# Altium schematic sheet digital_input_module.SchDoc
size A3
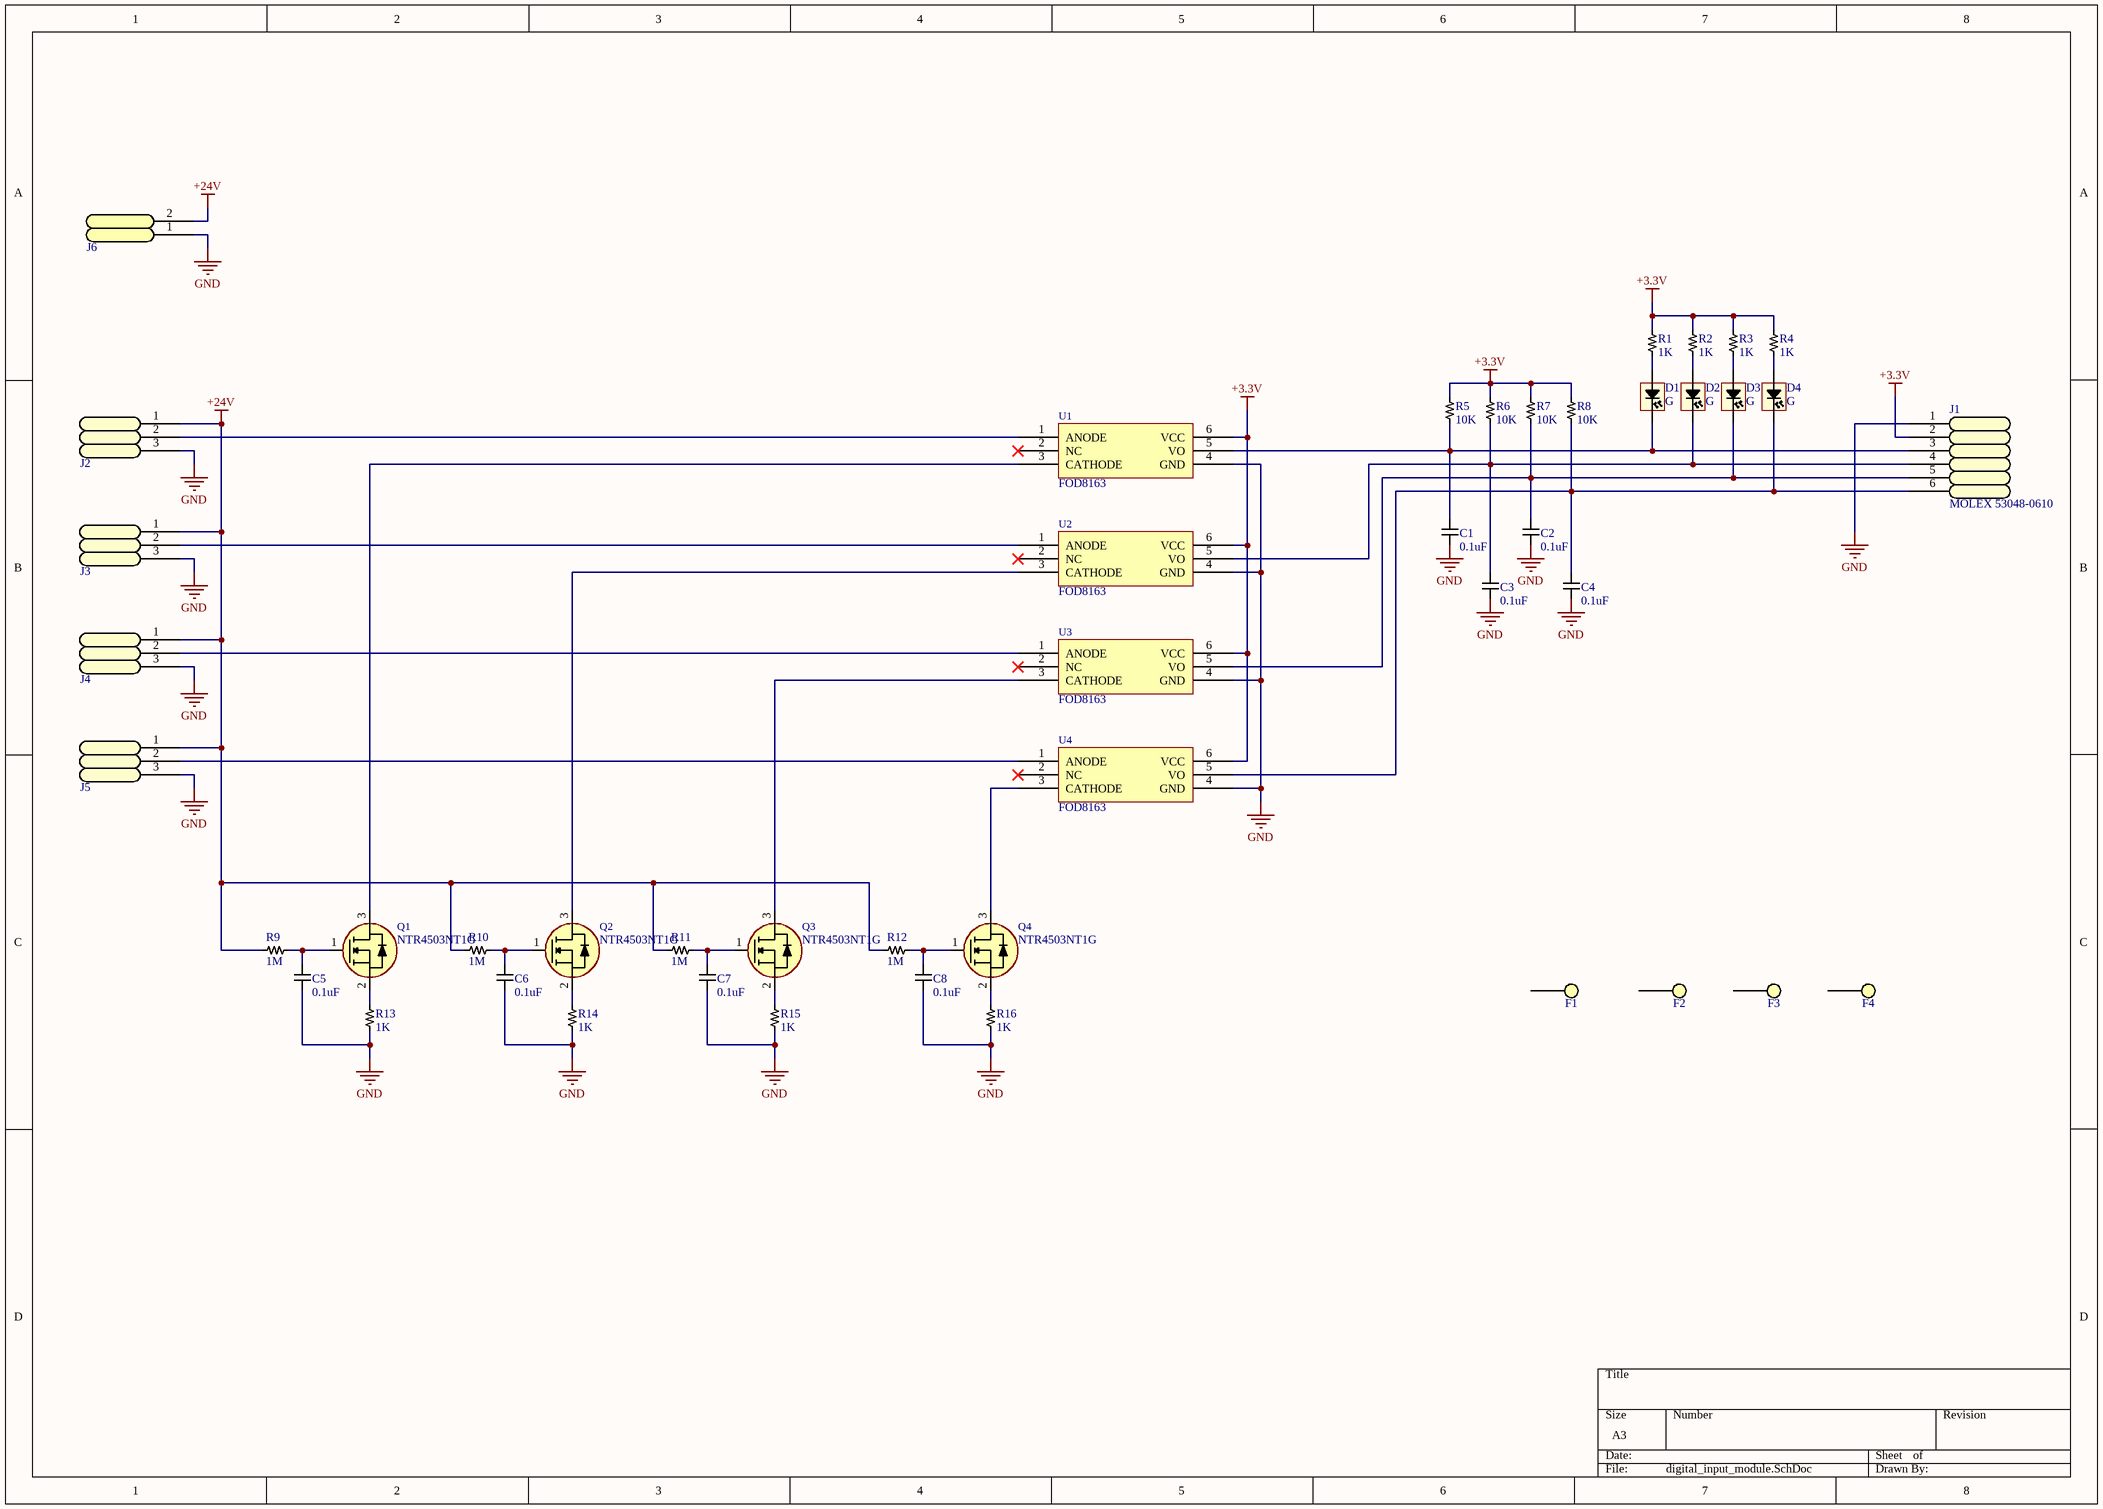
[diagram p0: digital_input_module.SchDoc]

## Parts
C1  value 0.1uF  [CAP1608L]  (hidden comment: C)
C2  value 0.1uF  [CAP1608L]  (hidden comment: C)
C3  value 0.1uF  [CAP1608L]  (hidden comment: C)
C4  value 0.1uF  [CAP1608L]  (hidden comment: C)
C5  value 0.1uF  [CAP1608L]  (hidden comment: C)
C6  value 0.1uF  [CAP1608L]  (hidden comment: C)
C7  value 0.1uF  [CAP1608L]  (hidden comment: C)
C8  value 0.1uF  [CAP1608L]  (hidden comment: C)
D1  value G  [LED1608L]  (hidden comment: LED)
D2  value G  [LED1608L]  (hidden comment: LED)
D3  value G  [LED1608L]  (hidden comment: LED)
D4  value G  [LED1608L]  (hidden comment: LED)
F1  FIXED_HOLE  [FIXED_HOLE_PAD]  (value not drawn)
F2  FIXED_HOLE  [FIXED_HOLE_PAD]  (value not drawn)
F3  FIXED_HOLE  [FIXED_HOLE_PAD]  (value not drawn)
F4  FIXED_HOLE  [FIXED_HOLE_PAD]  (value not drawn)
J1  MOLEX 53048-0610  [MOLEX-53254-0670]
J2  MCON-3  [MOLEX-53254-0370]  (value not drawn)
J3  MCON-3  [MOLEX-53254-0370]  (value not drawn)
J4  MCON-3  [MOLEX-53254-0370]  (value not drawn)
J5  MCON-3  [MOLEX-53254-0370]  (value not drawn)
J6  CON2  [DG128-5.0-02P]  (value not drawn)
Q1  value NTR4503NT1G  [SOT-23-3]  (hidden comment: NTR4503N)
Q2  value NTR4503NT1G  [SOT-23-3]  (hidden comment: NTR4503N)
Q3  value NTR4503NT1G  [SOT-23-3]  (hidden comment: NTR4503N)
Q4  value NTR4503NT1G  [SOT-23-3]  (hidden comment: NTR4503N)
R1  value 1K  [RES1608L]  (hidden comment: R)
R2  value 1K  [RES1608L]  (hidden comment: R)
R3  value 1K  [RES1608L]  (hidden comment: R)
R4  value 1K  [RES1608L]  (hidden comment: R)
R5  value 10K  [RES1608L]  (hidden comment: R)
R6  value 10K  [RES1608L]  (hidden comment: R)
R7  value 10K  [RES1608L]  (hidden comment: R)
R8  value 10K  [RES1608L]  (hidden comment: R)
R9  value 1M  [RES1608L]  (hidden comment: R)
R10  value 1M  [RES1608L]  (hidden comment: R)
R11  value 1M  [RES1608L]  (hidden comment: R)
R12  value 1M  [RES1608L]  (hidden comment: R)
R13  value 1K  [RES1608L]  (hidden comment: R)
R14  value 1K  [RES1608L]  (hidden comment: R)
R15  value 1K  [RES1608L]  (hidden comment: R)
R16  value 1K  [RES1608L]  (hidden comment: R)
U1  FOD8163  [SOP-6W]
U2  FOD8163  [SOP-6W]
U3  FOD8163  [SOP-6W]
U4  FOD8163  [SOP-6W]

## Nets
+3.3V: J1.2 R1.2 R2.2 R3.2 R4.2 R5.2 R6.2 R7.2 R8.2 U1.6(VCC) U2.6(VCC) U3.6(VCC) U4.6(VCC)
+24V: J2.1 J3.1 J4.1 J5.1 J6.2 R9.1 R10.1 R11.1 R12.1
GND: C1.2 C2.2 C3.2 C4.2 C5.2 C6.2 C7.2 C8.2 J1.1 J2.3 J3.3 J4.3 J5.3 J6.1 R13.1 R14.1 R15.1 R16.1 U1.4(GND) U2.4(GND) U3.4(GND) U4.4(GND)
NetC1_1: C1.1 D1.2 J1.3 R5.1 U1.5(VO)
NetC2_1: C2.1 D3.2 J1.5 R7.1 U3.5(VO)
NetC3_1: C3.1 D2.2 J1.4 R6.1 U2.5(VO)
NetC4_1: C4.1 D4.2 J1.6 R8.1 U4.5(VO)
NetC5_1: C5.1 Q1.1(G) R9.2
NetC6_1: C6.1 Q2.1(G) R10.2
NetC7_1: C7.1 Q3.1(G) R11.2
NetC8_1: C8.1 Q4.1(G) R12.2
NetD1_1: D1.1 R1.1
NetD2_1: D2.1 R2.1
NetD3_1: D3.1 R3.1
NetD4_1: D4.1 R4.1
NetJ2_2: J2.2 U1.1(ANODE)
NetJ3_2: J3.2 U2.1(ANODE)
NetJ4_2: J4.2 U3.1(ANODE)
NetJ5_2: J5.2 U4.1(ANODE)
NetQ1_2: Q1.2(S) R13.2
NetQ1_3: Q1.3(D) U1.3(CATHODE)
NetQ2_2: Q2.2(S) R14.2
NetQ2_3: Q2.3(D) U2.3(CATHODE)
NetQ3_2: Q3.2(S) R15.2
NetQ3_3: Q3.3(D) U3.3(CATHODE)
NetQ4_2: Q4.2(S) R16.2
NetQ4_3: Q4.3(D) U4.3(CATHODE)

Not connected (* = marked no-connect by the designer): F1 1; F2 1; F3 1; F4 1; U1 2(NC)*; U2 2(NC)*; U3 2(NC)*; U4 2(NC)*

## Library data of the parts
C1-C8 = C: Non-polarized Capacitor
J1 = MCON-6
J6 = CON2: Generic Connector 2 Pin
Q1-Q4 = NTR4503N: Power MOSFET,  30 V, 2.5 A, Single N−Channel, SOT−23; Supplier 1: Mouser; Supplier Part Number 1: 863-NTR4503NST1G
R1-R16 = R: Resistor
U1-U4 = FOD8163: Logic Output Optocouplers 3.3V/5V Logic Gate Optocoupler; Supplier 1: Mouser; Supplier Part Number 1: 512-FOD8163; Value: FOD8163